# EAGLE design Contactor Logic (EAGLE 5.12)
PARTNO: MCPRW020JW751B00
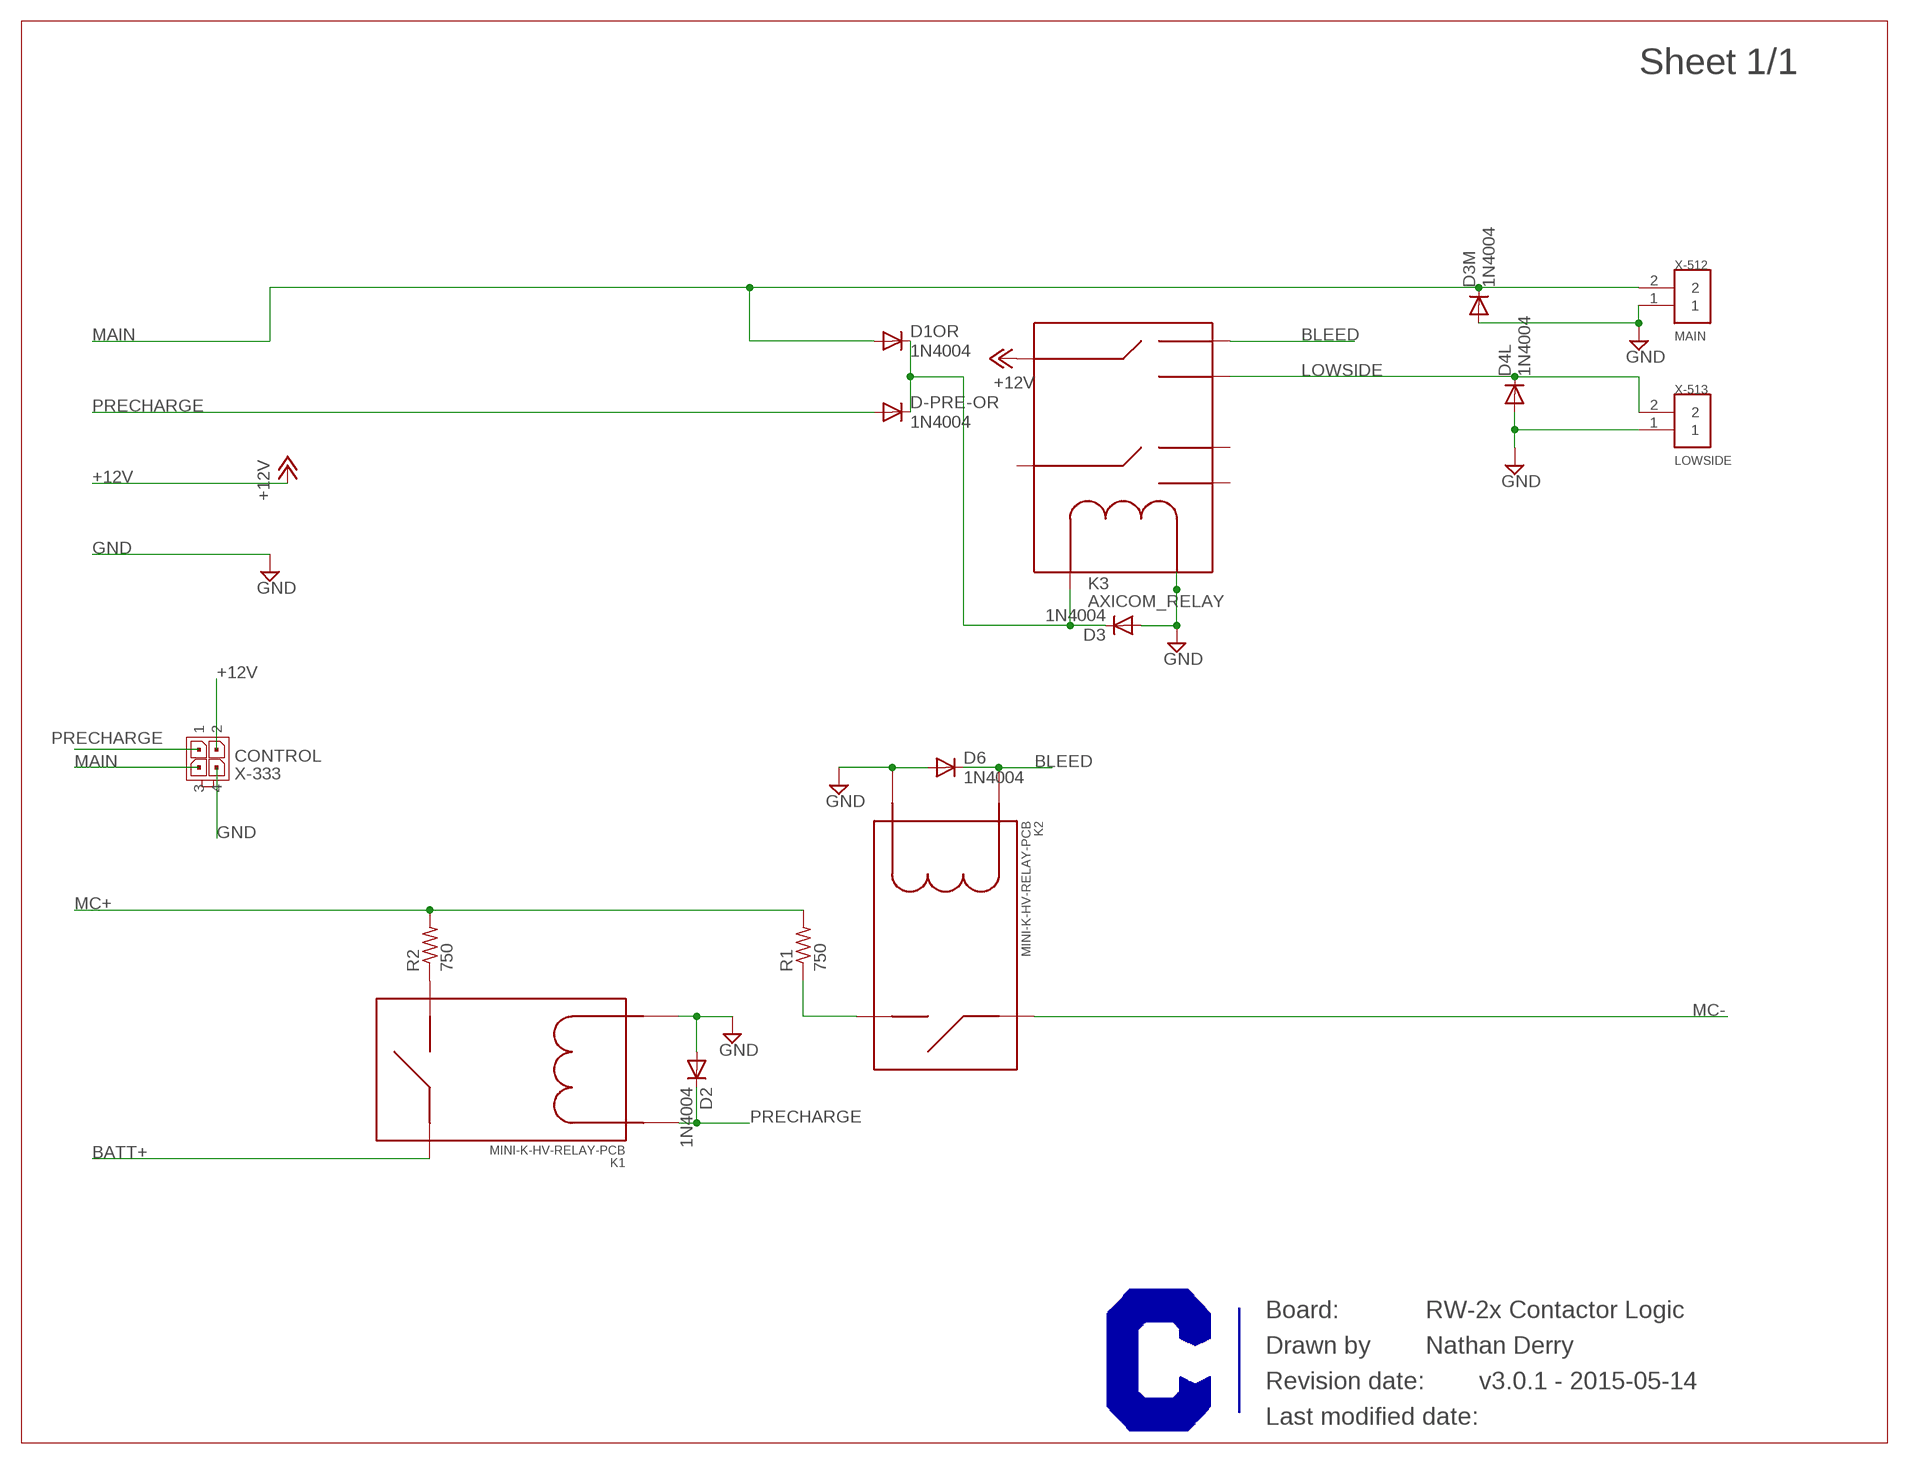
[diagram p0: schematic, sheet 1]

## Parts
D1OR  1N4004  [DO41-10]
D2  1N4004  [DO41-10]
D3  1N4004  [DO41-10]
D3M  1N4004  [DO41-10]
D4L  1N4004  [DO41-10]
D6  1N4004  [DO41-10]
D-PRE-OR  1N4004  [DO41-10]
K1  MINI-K-HV-RELAY-PCB  [MINI-K-RELAY_V23700C_PCB]
K2  MINI-K-HV-RELAY-PCB  [MINI-K-RELAY_V23700C_PCB]
K3  AXICOM_RELAY  [AXICOM_RELAY]
R1  750  R-US_MCPRWXX_AXIAL  [MCPRWXX_RESISTOR_AXIAL]
R2  750  R-US_MCPRWXX_AXIAL  [MCPRWXX_RESISTOR_AXIAL]
U$1  CURRENT-C-LETTER-LANDSCAPE  [BLANK]
X-333  CONTROL  MICROFIT-04-DUAL-RA-SMD-CLIP_RETENTION  [MICROFIT-4-DUAL-RA-SMD-CLIP_RETENTION]
X-512  MAIN  DURACLIK02  [DURACLIK-02]
X-513  LOWSIDE  DURACLIK02  [DURACLIK-02]

## Nets
+12V: K3.L1 X-333.2
BATT+: K1.5
BLEED: D6.C K2.1(COIL+) K3.NC1
D2OR: D1OR.C D3.C D-PRE-OR.C K3.COIL(+)
GND: D2.A D3.A D3M.A D4L.A D6.A K1.2(COIL-) K2.2(COIL-) K3.COIL(-) X-333.4 X-512.1 X-513.1
LOWSIDE: D4L.C K3.NO1 X-513.2
MAIN: D1OR.A D3M.C X-333.3 X-512.2
MC+: R1.2 R2.2
MC-: K2.5
N$1: K1.7 R2.1
N$4: K2.7 R1.1
PRECHARGE: D2.C D-PRE-OR.A K1.1(COIL+) X-333.1
Unconnected: K3.L2 K3.NC2 K3.NO2

## Notes on the sheet
- RW-2x Contactor Logic
- Nathan Derry
- v3.0.1 - 2015-05-14

## Library data of the parts
D1OR D2 D3 D3M D4L D6 D-PRE-OR = diode:1N4004: DIODE general purpose rectifier, 1 A
K1 K2 = TE-Aaron:MINI-K-HV-RELAY: TE Mini K HV Relay; PARTNO: V23700-C0001-A408
K3 = TE-Aaron:AXICOM_RELAY: Datasheet: http://datasheet.octopart.com/5-1393788-7-Tyco-Electronics-datasheet-511509.pdf Axicom Relay used in HV Ctrl Ckt Ndd 11/30; PARTNO: V23079D1003B301
R1 R2 = rcl:R-US_: RESISTOR, American symbol
U$1 = Frames:CURRENT-C-LETTER-LANDSCAPE; BOM: EXCLUDE
X-333 = Molex:MICROFIT-04-DUAL: Molex MicroFit 3.00mm Pitch Header, Surface Mount, Dual Row, 4 Circuits Molex P/N: 43045-0609 (vert) Drawing: http://www.molex.com/pdm_docs/sd/430450418_sd.pdf (vert) Information: http://www.molex.com/molex/products/datasheet.jsp?part=active/0430450418_PCB_HEADERS.xml (vert)
X-512 X-513 = BMC components:DURACLIK

## Board
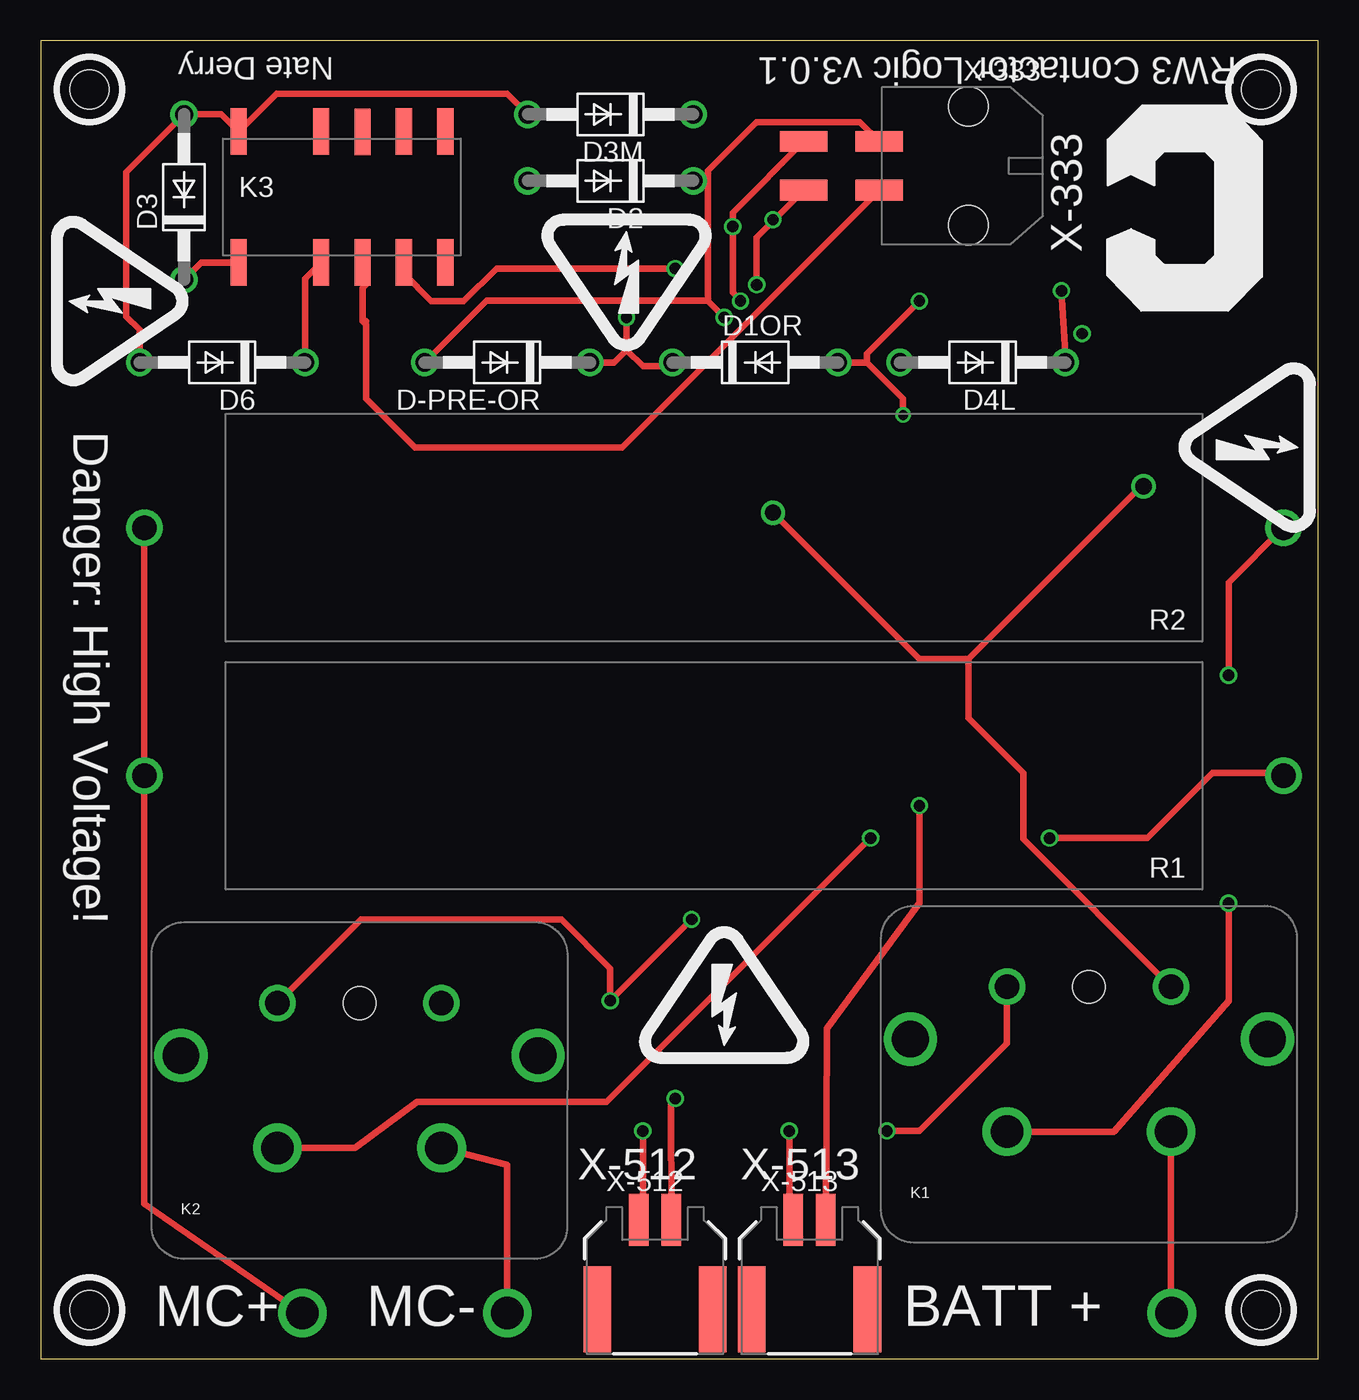
[diagram p1: board, top side]
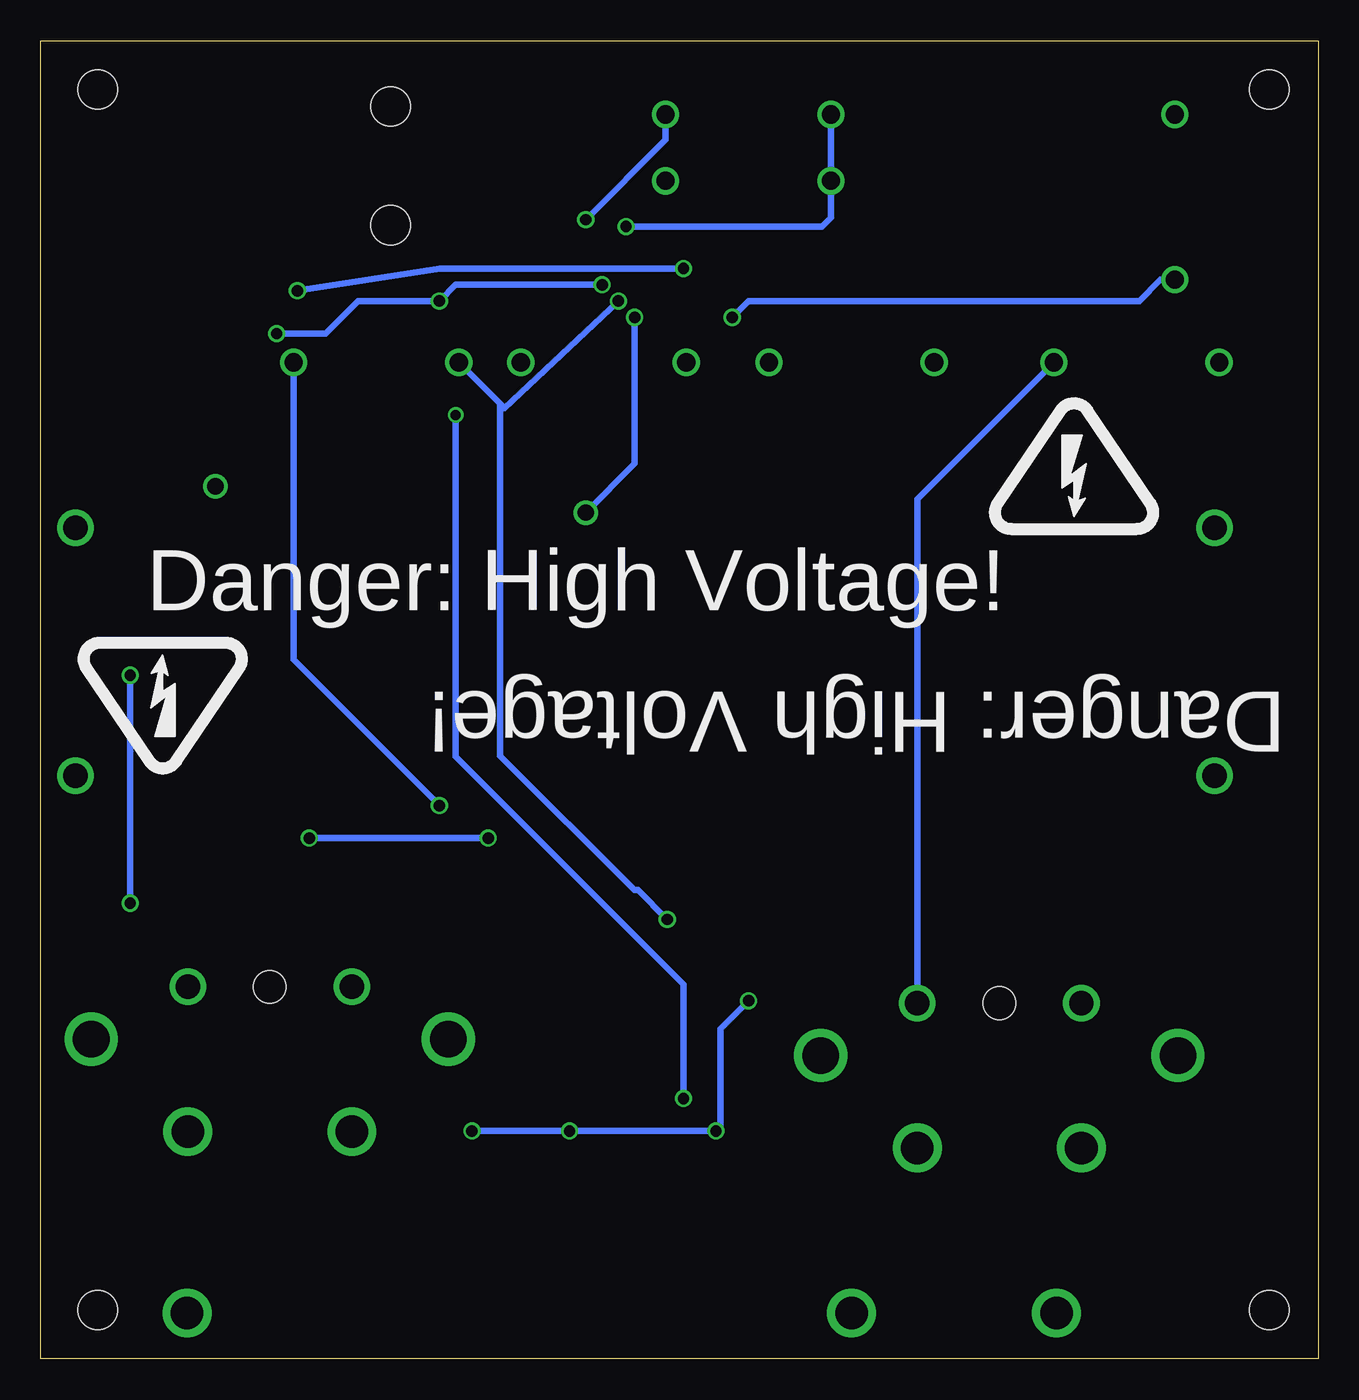
[diagram p2: board, bottom side, seen from below]

Size 78.5 x 81 mm. Coordinates in mm from the lower left corner, seen from the top.
Outline: 0,0 78.5,0 78.5,81 0,81 0,0
Copper layers (1*16): Top 0.0356mm / dielectric 1.5011mm / Bottom 0.0356mm
Design rules "OSH Park 2-layer": minimum track width 6mil, minimum drill 13mil, track to track 6mil, track to pad 6mil, pad to pad 6mil, via to via 6mil, smd to smd 6mil, copper to edge 15mil, drill to drill 6mil, minimum pad ring 7mil, minimum via ring 7mil, stop-mask expansion 4mil, vias tented up to drill 25mil, thermal gap 10mil
Holes 2.4 mm at 3,3 75,3 75,78 3,78

### Footprints (pad centres in the part's own frame; a part is rotated, then mirrored left to right if it is on the bottom)
DO41-10 = drill 1.118 round: A 5.08,0; C -5.08,0
MINI-K-RELAY_V23700C_PCB = drill 1.5 round: 1 5.04,0; 2 -5.04,0 | drill 2 round: 5 5.04,-8.9; 7 -5.04,-8.9 | drill 2.25 round: 8A -10.975,-3.22; 8B 10.975,-3.22 | hole 2: 0,0
AXICOM_RELAY = smd 1 x 2.85: COIL(+) -6.35,-4.025; COIL(-) -6.35,4.025; L1 1.27,-4.025; L2 1.27,4; NC1 -1.27,-4.025; NC2 -1.27,4.025; NO1 3.81,-4.025; NO2 3.81,4.025; NOUSE1 6.35,-4.025; NOUSE2 6.35,4.025
MCPRWXX_RESISTOR_AXIAL = drill 1.5 round: 1 -35,0; 2 35,0
MICROFIT-4-DUAL-RA-SMD-CLIP_RETENTION = smd 1.27 x 2.921: 1 1.5,5.47; 2 -1.5,5.47; 3 -1.5,10.1; 4 1.5,10.1 | hole 2.413: 3.65,0; -3.65,0
DURACLIK-02 = smd 1.2 x 3.2: 1 -1,8.23; 2 1,8.23 | smd 1.7 x 5.3: P$3 -3.55,2.75; P$4 3.55,2.75

### Placement (x,y rotation side)
D1OR  43.91,61.23 0 top
D2  35.02,72.39 180 top
D3  8.81,71.39 90 top
D3M  35.02,76.47 180 top
D4L  57.88,61.23 180 top
D6  11.16,61.23 180 top
D-PRE-OR  28.67,61.23 180 top
E$1  [HV_SYMBOL]  15,56 0 bottom
E$2  [HV_SYMBOL]  71,39 180 bottom
K1  64.42,22.86 0 top
K2  19.59,21.86 0 top
K3  18.51,71.39 0 top
R1  41.37,35.83 180 top
R2  41.37,51.07 180 top
U$1  5.23,54.74 0 top
U$2  [CURRENT-0.5"]  75,77 180 top
U$3  [HV_SYMBOL]  36,65 180 top
U$4  [HV_SYMBOL]  73,56 90 top
U$5  [HV_SYMBOL]  42,23.5 0 top
U$6  [HV_SYMBOL]  6,65 270 top
X-333  57,73.31 90 top
X-512  37.75,0.3 0 top
X-513  47.25,0.3 0 top

### Tracks (layer width: path | path; a pad name or v marks a point on that pad's centre or on a via)
+12V
  Top 0.406: 19.78,63.77 20,63.77 | 19.78,63.77 20,63.55 20,59 23,56 31,56 35.72,56 X-333.2 | 19.78,63.77 19.78,65.78 20,66 20,67.14 K3.L1
BATT+  (via drill 2)
  Top 0.406: K1.5 69.46,3.85 v69.5,2.81
BLEED
  Top 0.406: K3.NC1 16.24,66.36 D6.C
  Bottom 0.406: D6.C 24.63,52.84 K2.1
D2OR  (via drill 0.7)
  Top 0.406: D-PRE-OR.C 35.23,61.23 36,62 | 36,62 37,61 38.6,61 D1OR.C | v36,64 36,62 | K3.COIL(+) 9.87,67.36 D3.C
  Bottom 0.406: 36,63.77 v36,64 35,65 11,65 9.69,66.31 D3.C
GND  (via drill 0.7)
  Top 0.406: D3M.A 28.67,77.74 14.48,77.74 K3.COIL(-) 11.11,76.47 D3.A 5.27,72.93 5.27,64.04 6.08,63.23 D6.A | v43,65 42.53,65.53 v42.53,69.58 42.53,70.44 X-333.4 | v35,22 34.86,21.86 | v35,22 v40,27 | v52,14 54,14 58,18 59.38,19.38 K1.2 | X-512.1 37,7.86 v37,14 | X-513.1 46,7.86 v46,14 | K2.2 19.69,27 32,27 35,24 v35,22
  Bottom 0.406: 50,58.43 D4L.A | v42.53,69.58 30.48,69.58 29.94,70.12 D2.A D3M.A | 50,58.43 v43,65 | 50,58.43 50.26,58.69 50.26,37.06 42,28.8 41.8,28.8 v40,27 | v52,14 v46,14 v37,14 36.74,14 36.74,20.26 v35,22
LOWSIDE  (via drill 0.7)
  Top 0.406: K3.NO1 22.32,66.68 24,65 26,65 28,67 v39,67 | v54,34 54,28 48.31,20.31 X-513.2 | v62.73,65.64 63,61.27 D4L.C
  Bottom 0.406: v39,67 54,67 v62.73,65.64 | D4L.C 62.96,42.96 v54,34
MAIN  (via drill 0.6, 0.7)
  Top 0.406: 49.77,61.23 D1OR.A 50.77,61.23 | 50.77,61.23 53,59 v53,58 | 50.77,61.23 50.77,61.77 v54,65 | X-512.2 38.74,15.74 v39,16 | v44,66 44,68.91 44.55,69.45 | 44.55,69.45 X-333.3 | v45,70 45,69.91 44.55,69.45
  Bottom 0.406: v44,66 53,66 v54,65 59,65 61,63 v64,63 | v53,58 53,37 39,23 v39,16 | D3M.C 40.1,74.9 v45,70 45.05,69.95
MC+  (via drill 2)
  Top 0.406: v16.08,2.81 6.37,9.52 R1.2 R2.2
MC-  (via drill 2)
  Top 0.406: v28.67,2.81 28.67,11.92 K2.5
N$1  (via drill 0.7)
  Top 0.406: K1.7 65.96,13.96 73,22 v73,28 | v73,42 73,47.7 R2.1
  Bottom 0.406: v73,28 v73,42
N$4  (via drill 0.7)
  Top 0.406: K2.7 19.31,12.96 23.13,15.78 34.78,15.78 v51,32 | v62,32 68,32 72,36 76.2,36 R1.1
  Bottom 0.406: v51,32 v62,32
PRECHARGE  (via drill 0.7, 1)
  Top 0.406: D-PRE-OR.A 27.4,65.04 40.96,65.04 41,65 | 41,65 v42,64 | 41,65 41,70.49 41,72.39 | v67.77,53.61 67.61,53.61 57,43 | 57,43 54,43 v45,52 | 57,43 57,39.38 60.38,36 60.38,31.94 K1.1 | 41,72.39 D2.C | 41,72.39 41,73 44,76 50.34,76 X-333.1
  Bottom 0.406: v42,64 42,55 v45,52 | v67.77,53.61 68,53.61

### Text on the board
tPlace: Nate Derry | RW3 Contactor Logic v3.0.1 | X-333 | Danger: High Voltage! | X-512 | X-513 | MC+ | MC- | BATT +
bPlace: Danger: High Voltage! | Danger: High Voltage!